# Altium schematic sheet LPEDT_revA1_bikeit_MCU_RADIO.SchDoc: MCU Antenna & Radio Interface
size A3; Author: Dhruva Koley; DocumentNumber: 5; Revision: 1; SheetNumber: 4; SheetTotal: 11
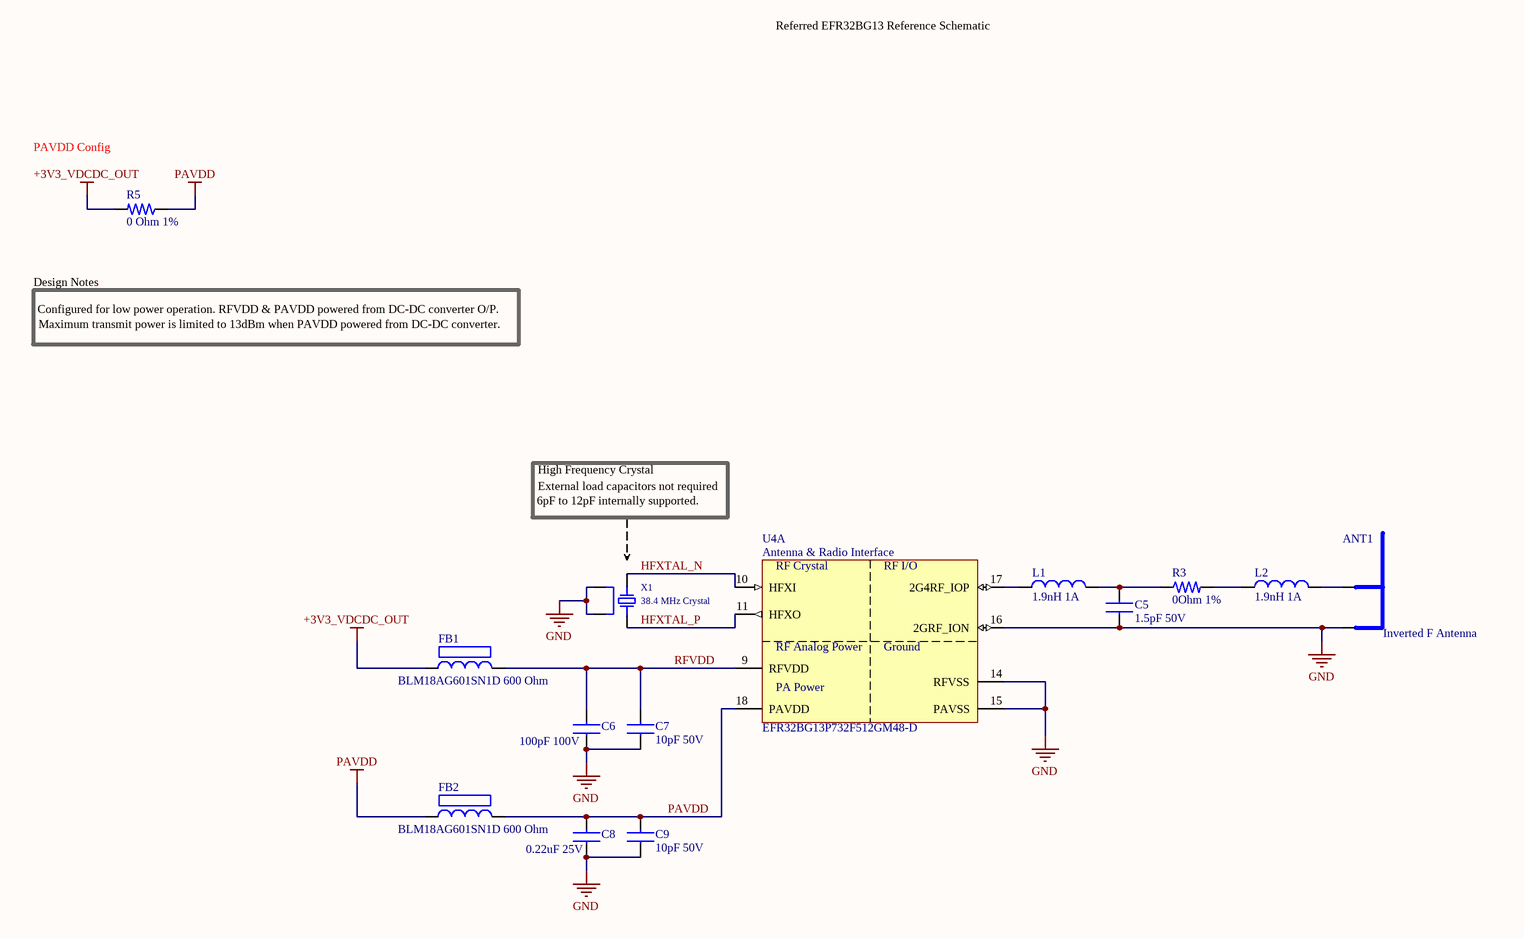
[diagram p0: LPEDT_revA1_bikeit_MCU_RADIO.SchDoc]

## Parts
ANT1  Inverted F Antenna  (net tie, no BOM)
C5  1.5pF 50V  [CAP_0403_1.00mm*0.50mm]
C6  100pF 100V  [CAP_0603_1.60mm*0.80mm]
C7  10pF 50V  [CAP_0603_1.60mm*0.80mm]
C8  0.22uF 25V  [CAP_0603_1.60mm*0.80mm]
C9  10pF 50V  [CAP_0603_1.60mm*0.80mm]
FB1  BLM18AG601SN1D 600 Ohm  [Chip2PinSM127P600-8N]
FB2  BLM18AG601SN1D 600 Ohm  [Chip2PinSM127P600-8N]
L1  1.9nH 1A
L2  1.9nH 1A
R3  0Ohm 1%  [RESC1005X04N]
R5  0 Ohm 1%  [RESC1005X04N]
U4  EFR32BG13P732F512GM48-D  [QFN50P700X700X90_HS-49N]  (part A of 3)
X1  38.4 MHz Crystal

## Nets
+3V3_VDCDC_OUT: FB1.1 R5.2
GND: ANT1.2(GND) C5.2 C6.2 C7.2 C8.2 C9.2 U4.14(RFVSS) U4.15(PAVSS) U4.16(2GRF_ION) X1.2(GND) X1.4(GND)
PAVDD: C8.1 C9.1 FB2.1 FB2.2 R5.1 U4.18(PAVDD)
HFXTAL_N: U4.10(HFXI) X1.3(HOT)
HFXTAL_P: U4.11(HFXO) X1.1(HOT)
RFVDD: C6.1 C7.1 FB1.2 U4.9(RFVDD)
NetANT1_1: ANT1.1(FEED) L2.2
NetC5_1: C5.1 L1.2 R3.1
NetL1_1: L1.1 U4.17(2G4RF_IOP)
NetL2_1: L2.1 R3.2

## Notes on the sheet
- Referred EFR32BG13 Reference Schematic
- PAVDD Config
- Design Notes
- Configured for low power operation. RFVDD & PAVDD powered from DC-DC converter O/P.
- Maximum transmit power is limited to 13dBm when PAVDD powered from DC-DC converter.
- 6pF to 12pF internally supported.
- High Frequency Crystal
- External load capacitors not required
- (in symbol EFR32BG13P732F512GM48-D, part A) Antenna & Radio Interface; RF Crystal; RF I/O; RF Analog Power; Ground; PA Power

## Library data of the parts
ANT1 = Inverted F Antenna: Inverted F antenna for BT
C5 = 500R07S1R5BV4T: 1.5pF ±0.1pF 50V Ceramic Capacitor C0G, NP0 0402 (1005 Metric); Manufacturer: Johanson Technology Inc.; Manufacturer Part Number: 500R07S1R5BV4T; RoHS Compliant: Yes; Supplier 1: Digi-Key; Supplier Part Number 1: 712-1270-1-ND
C6 = GRM1885C2A101FA01D: Multilayer Ceramic Capacitors MLCC - SMD/SMT 100pF 100Volts C0G 0.01; Manufacturer: Murata; Tolerance: 1%; Manufacturer Part Number: GRM1885C2A101FA01D; RoHS: Yes; Category: Ceramic Capacitors; Stock 1: 40000; Pricing 1: 4000=0.03696, 8000=0.03511, 12000=0.03326, 28000=0.03142 (USD); Mount: Surface Mount; Case/Package: 0603; Case Code (Imperial): 0603; Case Code (Metric): 1608; Min Operating Temperature: -55°C; Max Operating Temperature: 125°C; Packaging: Tape and Reel; Package Quantity: 4000; Capacitance: 100pF; Voltage Rating: 100V; Dielectric: C0G; Voltage Rating (DC): 100V; Length: 1.6mm; Width: 0.031inch; Height: 0.8mm; Thickness: 0.035inch; Depth: 0.8mm; Radiation Hardening: No; ComponentLink1URL: https://datasheet.ciiva.com/29537/partnumbering-e-01-29537864.pdf?src-supplier=Digi-Key; ComponentLink1Description: https://datasheet.ciiva.com/29537/partnumbering-e-01-29537864.pdf?src-supplier=Digi-Key; Supplier 1: Digi-Key; Supplier Part Number 1: 490-14623-1-ND
C7 C9 = GRM1885C1H100FA01D: Cap Ceramic 10pF 50V C0G 1% SMD 0603 125C T/R; Manufacturer: Murata; Temperature Coefficient: 30ppm/°C; Supplier 1: Digi-Key; Manufacturer Part Number: GRM1885C1H100FA01D; RoHS: Yes; Category: Ceramic Capacitors; Stock 1: 160; Pricing 1: 1=0.15000, 10=0.11000, 50=0.06240, 100=0.05170 (USD); Mount: Surface Mount; Case/Package: 0603; Case Code (Metric): 1608; Case Code (Imperial): 0603; Material: Ceramic; Min Operating Temperature: -55°C; Max Operating Temperature: 125°C; Packaging: Tape and Reel; Capacitance: 10pF; Tolerance: 1%; Voltage Rating: 50V; Package Quantity: 4000; Voltage Rating (DC): 50V; Dielectric: C0G; Termination: SMD/SMT; Voltage: 50V; Series: GRM; Construction: Flat; Length: 1.6mm; Width: 0.8mm; Height: 0.8mm; Thickness: 0.035inch; Depth: 0.8mm; Radiation Hardening: No; Lead Free: Lead Free; RoHS Compliant: Yes; ComponentLink1URL: https://datasheet.ciiva.com/2989/c02e-2989424.pdf?src-supplier=Avnet; ComponentLink1Description: https://datasheet.ciiva.com/2989/c02e-2989424.pdf?src-supplier=Avnet; ComponentLink2URL: https://datasheet.ciiva.com/166/partnumbering-e-01-166098.pdf?src-supplier=Digi-Key; ComponentLink2Description: https://datasheet.ciiva.com/166/partnumbering-e-01-166098.pdf?src-supplier=Digi-Key; ComponentLink3URL: https://datasheet.ciiva.com/45259/partnumbering-e-01-45259517.pdf?src-supplier=Digi-Key; ComponentLink3Description: https://datasheet.ciiva.com/45259/partnumbering-e-01-45259517.pdf?src-supplier=Digi-Key; ComponentLink4URL: https://datasheet.ciiva.com/17453/c02e-17453134.pdf?src-supplier=Avnet+Europe; ComponentLink4Description: https://datasheet.ciiva.com/17453/c02e-17453134.pdf?src-supplier=Avnet+Europe; Supplier Part Number 1: 490-9713-1-ND
C8 = GRM188R71E224KA88D: Capacitor 220 nF 25 VDC PU=4000 ST, GRM188R71E224KA88D, Murata; Material: Ceramic; Capacitance: 220nF; Tolerance: 10%; Dielectric: X7R; Voltage: 50V; Supplier 1: Digi-Key; Manufacturer: Murata; Manufacturer Part Number: GRM188R71E224KA88D; RoHS: Yes; Category: Ceramic Capacitors; Stock 1: 208118; Pricing 1: 1=0.20000, 10=0.13700, 50=0.08240, 100=0.06960, 500=0.04760, 1000=0.04210 (USD); Mount: Surface Mount; Case/Package: 0603; Number of Pins: 2; Case Code (Imperial): 0603; Case Code (Metric): 1608; Min Operating Temperature: -55°C; Max Operating Temperature: 125°C; Voltage Rating: 25V; Voltage Rating (DC): 25V; Packaging: Tape and Reel; Package Quantity: 1; Termination: SMD/SMT; Length: 1.6mm; Width: 0.8mm; Height: 0.8mm; Thickness: 0.035inch; Depth: 0.8mm; Radiation Hardening: No; REACH SVHC: No SVHC; Lead Free: Lead Free; RoHS Compliant: Yes; ComponentLink1URL: https://datasheet.ciiva.com/5411/product-5411362.pdf?src-supplier=Mouser; ComponentLink1Description: https://datasheet.ciiva.com/5411/product-5411362.pdf?src-supplier=Mouser; ComponentLink2URL: https://datasheet.ciiva.com/11786/0900766b807a1cab-11786308.pdf?src-supplier=RSComponents; ComponentLink2Description: https://datasheet.ciiva.com/11786/0900766b807a1cab-11786308.pdf?src-supplier=RSComponents; ComponentLink3URL: https://datasheet.ciiva.com/6068/1784408-6068393.pdf?src-supplier=Farnell; ComponentLink3Description: https://datasheet.ciiva.com/6068/1784408-6068393.pdf?src-supplier=Farnell; ComponentLink4URL: https://datasheet.ciiva.com/133/grm188r71e224ka88-01-133883.pdf?src-supplier=Digi-Key; ComponentLink4Description: https://datasheet.ciiva.com/133/grm188r71e224ka88-01-133883.pdf?src-supplier=Digi-Key; ComponentLink5URL: https://datasheet.ciiva.com/133/grm188r71e224ka88-01-133884.pdf?src-supplier=Digi-Key; ComponentLink5Description: https://datasheet.ciiva.com/133/grm188r71e224ka88-01-133884.pdf?src-supplier=Digi-Key; ComponentLink6URL: https://datasheet.ciiva.com/3777/1531grm188r71e224ka8823-3777688.pdf?src-supplier=Arrow+Electronics; ComponentLink6Description: https://datasheet.ciiva.com/3777/1531grm188r71e224ka8823-3777688.pdf?src-supplier=Arrow+Electronics; ComponentLink7URL: https://datasheet.ciiva.com/29202/451619-da-01-en-vs-kondensator-0603-29202002.pdf?src-supplier=Conrad; ComponentLink7Description: https://datasheet.ciiva.com/29202/451619-da-01-en-vs-kondensator-0603-29202002.pdf?src-supplier=Conrad; ComponentLink8URL: https://datasheet.ciiva.com/14116/nmgrm-data-en-14116629.pdf?src-supplier=Distrelec; ComponentLink8Description: https://datasheet.ciiva.com/14116/nmgrm-data-en-14116629.pdf?src-supplier=Distrelec; ComponentLink9URL: https://datasheet.ciiva.com/16425/product-16425866.pdf?src-supplier=Future+Electronics; ComponentLink9Description: https://datasheet.ciiva.com/16425/product-16425866.pdf?src-supplier=Future+Electronics; ComponentLink10URL: https://datasheet.ciiva.com/22703/1784408-22703338.pdf?src-supplier=Element14; ComponentLink10Description: https://datasheet.ciiva.com/22703/1784408-22703338.pdf?src-supplier=Element14; ComponentLink11URL: https://datasheet.ciiva.com/7937/1784408-7937645.pdf?src-supplier=Element14; ComponentLink11Description: https://datasheet.ciiva.com/7937/1784408-7937645.pdf?src-supplier=Element14; ComponentLink12URL: https://datasheet.ciiva.com/48436/nmgrm-data-en-48436687.pdf?src-supplier=Distrelec; ComponentLink12Description: https://datasheet.ciiva.com/48436/nmgrm-data-en-48436687.pdf?src-supplier=Distrelec; Supplier Part Number 1: 490-3290-1-ND
FB1 FB2 = BLM18AG601SN1D: Ferrite Bead, 0603 / 1608, 600 ohm, 500 mA, Série BLM18A, 0.38 ohm, ± 25%; Manufacturer: Murata; Material: Steel,Ferrite; Frequency: 100MHz; Impedance: 600R; Max Current Rating: 500mA; Number of Lines: 1; DC Resistance (DCR): 380mR; Shielding: Unshielded; Supplier 1: Digi-Key; Manufacturer Part Number: BLM18AG601SN1D; RoHS: Yes; Category: Inductors; Stock 1: 826617; Pricing 1: 1=0.10000, 10=0.07200, 25=0.06560, 50=0.05900, 100=0.04320, 250=0.03144, 500=0.02882, 1000=0.02489 (USD); Case/Package: 0603; Number of Pins: 2; Core Material: Ferrite; Case Code (Metric): 1608; Case Code (Imperial): 0603; Weight: 7.1E-05oz; Min Operating Temperature: -55°C; Max Operating Temperature: 125°C; Package Quantity: 1; Packaging: Tape and Reel; Tolerance: 25%; Current Rating: 500mA; Termination: SMD/SMT; Max DC Current: 500mA; Test Frequency: 100MHz; DC Current: 500mA; Number of Circuits: 1; Length: 1.6mm; Width: 0.8mm; Height: 0.8mm; Depth: 0.8mm; Radiation Hardening: No; RoHS Compliant: Yes; Lead Free: Lead Free; REACH SVHC: No SVHC; Military Standard: Not; ComponentLink1URL: https://datasheet.ciiva.com/19460/1844766-19460213.pdf?src-supplier=Jameco; ComponentLink1Description: https://datasheet.ciiva.com/19460/1844766-19460213.pdf?src-supplier=Jameco; ComponentLink2URL: https://datasheet.ciiva.com/29347/442309-da-01-en-chip-drossel-0603-600r-500ma-1-6x0-8mm-29347900.pdf?src-supplier=Conrad; ComponentLink2Description: https://datasheet.ciiva.com/29347/442309-da-01-en-chip-drossel-0603-600r-500ma-1-6x0-8mm-29347900.pdf?src-supplier=Conrad; ComponentLink3URL: https://datasheet.ciiva.com/41449/001172228-da-01-en-drossel-0603-600r-1-6x0-8mm-4000st-41449517.pdf?src-supplier=Conrad; ComponentLink3Description: https://datasheet.ciiva.com/41449/001172228-da-01-en-drossel-0603-600r-1-6x0-8mm-4000st-41449517.pdf?src-supplier=Conrad; ComponentLink4URL: https://datasheet.ciiva.com/1012/l0110s0100blm18a-1012017.pdf?src-supplier=Digi-Key; ComponentLink4Description: https://datasheet.ciiva.com/1012/l0110s0100blm18a-1012017.pdf?src-supplier=Digi-Key; ComponentLink5URL: https://datasheet.ciiva.com/1012/l0110s0100blm18a-1012018.pdf?src-supplier=Digi-Key; ComponentLink5Description: https://datasheet.ciiva.com/1012/l0110s0100blm18a-1012018.pdf?src-supplier=Digi-Key; ComponentLink6URL: https://datasheet.ciiva.com/1012/l0110s0100blm18a-1012019.pdf?src-supplier=Digi-Key; ComponentLink6Description: https://datasheet.ciiva.com/1012/l0110s0100blm18a-1012019.pdf?src-supplier=Digi-Key; ComponentLink7URL: https://datasheet.ciiva.com/1466/1756147-1466933.pdf?src-supplier=Element14; ComponentLink7Description: https://datasheet.ciiva.com/1466/1756147-1466933.pdf?src-supplier=Element14; ComponentLink8URL: https://datasheet.ciiva.com/1466/1756147-1466934.pdf?src-supplier=Element14; ComponentLink8Description: https://datasheet.ciiva.com/1466/1756147-1466934.pdf?src-supplier=Element14; ComponentLink9URL: https://datasheet.ciiva.com/16210/l0110s0100blm18a-16210006.pdf?src-supplier=Future+Electronics; ComponentLink9Description: https://datasheet.ciiva.com/16210/l0110s0100blm18a-16210006.pdf?src-supplier=Future+Electronics; ComponentLink10URL: https://datasheet.ciiva.com/3081/l0110s0100blm18a-3081613.pdf?src-supplier=Avnet; ComponentLink10Description: https://datasheet.ciiva.com/3081/l0110s0100blm18a-3081613.pdf?src-supplier=Avnet; Supplier Part Number 1: 490-1014-1-ND
L1 L2 = LQG15WZ1N9S02D: 1.9nH Unshielded Multilayer Inductor 1A 50mOhm Max 0402 (1005 Metric); RoHS: No; Category: Fixed Inductors; Supplier 1: Digi-Key; Supplier Part Number 1: 490-LQG15WZ1N9S02DCT-ND
R3 R5 = RMCF0402ZT0R00: RES 0 OHM JUMPER 1/16W 0402; Manufacturer: Stackpole Electronics; Resistance: 0R; Power Rating: 63mW; Current Rating: 1A; Working Voltage: 50V; Supplier 1: Digi-Key; Manufacturer Part Number: RMCF0402ZT0R00; RoHS: Yes; Category: Chip SMD Resistors; Stock 1: 5982991; Pricing 1: 1=0.10000, 10=0.01000, 25=0.00720, 50=0.00560, 100=0.00410, 250=0.00316, 500=0.00252, 1000=0.00186, 5000=0.00133 (USD); Mount: Surface Mount; Case/Package: 0402; Case Code (Metric): 1005; Case Code (Imperial): 0402; Contact Plating: Tin,Matte; Min Operating Temperature: -55°C; Max Operating Temperature: 155°C; Packaging: Tape and Reel; Resistor Type: Thick Film; Number of Terminations: 2; Max Power Dissipation: 63mW; Features: Automotive AEC-Q200; Series: RMCF; Technology: THICK FILM; Construction: Rectangular; Length: 0.039inch; Width: 0.02inch; Height: 0.016inch; Depth: 0.5mm; Radiation Hardening: No; Military Standard: Not; Lead Free: Lead Free; RoHS Compliant: Yes; ComponentLink1URL: https://datasheet.ciiva.com/26835/getdatasheetpartid-409751-26835612.pdf?src-supplier=Verical; ComponentLink1Description: https://datasheet.ciiva.com/26835/getdatasheetpartid-409751-26835612.pdf?src-supplier=Verical
U4 = EFR32BG13P732F512GM48-D: BLUE GECKO QFN48 2.4 GHZ 512KB 6; Manufacturer: Silicon Labs; Supplier 1: Digi-Key; Manufacturer Part Number: EFR32BG13P732F512GM48-D; RoHS: No; Category: RF Receivers, Transceivers; Pricing 1: 1=7.61000, 10=6.79200, 25=6.11320, 80=5.56988, 230=5.02643, 440=4.51023, 945=3.80380 (USD); ComponentLink1URL: http://www.farnell.com/datasheets/2813683.pdf?src-supplier=Farnell; ComponentLink1Description: http://www.farnell.com/datasheets/2813683.pdf?src-supplier=Farnell; Supplier Part Number 1: 336-5922-ND
X1 = CX2016DB38400D0FLJCC: CRYSTAL 38.4000MHZ 8PF SMD; Manufacturer: Kyocera AVX; Tolerance: 10ppm; ESR (Equivalent Series Resistance): 60R; Frequency Stability: 15ppm; Supplier 1: Digi-Key; Manufacturer Part Number: CX2016DB38400D0FLJCC; RoHS: Yes; Category: Crystals; Stock 1: 63853; Pricing 1: 1=0.65000, 10=0.57500, 50=0.53760, 100=0.47500, 500=0.45000, 1000=0.37500 (USD); Mount: Surface Mount; Case/Package: SMD/SMT; Min Operating Temperature: -30°C; Max Operating Temperature: 85°C; Frequency: 38.4MHz; Load Capacitance: 8pF; Packaging: Tape and Reel; Package Quantity: 3000; Frequency Tolerance: 10ppm; Termination: SMD/SMT; Length: 0.079inch; Width: 1.6mm; Height: 0.018inch; Lead Pitch: 1.4mm; ComponentLink1URL: https://datasheet.ciiva.com/26992/cx2016db-cs-e-26992341.pdf?src-supplier=Mouser; ComponentLink1Description: https://datasheet.ciiva.com/26992/cx2016db-cs-e-26992341.pdf?src-supplier=Mouser; ComponentLink2URL: https://datasheet.ciiva.com/29631/cx2016db-wl-e-29631639.pdf?src-supplier=Digi-Key; ComponentLink2Description: https://datasheet.ciiva.com/29631/cx2016db-wl-e-29631639.pdf?src-supplier=Digi-Key; ComponentLink3URL: https://datasheet.ciiva.com/29631/cx2016db-wl-e-29631640.pdf?src-supplier=Digi-Key; ComponentLink3Description: https://datasheet.ciiva.com/29631/cx2016db-wl-e-29631640.pdf?src-supplier=Digi-Key; ComponentLink4URL: https://datasheet.ciiva.com/29631/cx2016db-wl-e-29631641.pdf?src-supplier=Digi-Key; ComponentLink4Description: https://datasheet.ciiva.com/29631/cx2016db-wl-e-29631641.pdf?src-supplier=Digi-Key; Supplier Part Number 1: 1253-1119-1-ND